# Altium schematic sheet microcontroller.SchDoc
size A4; SheetNumber: 1; SheetTotal: 3; SPICEModelCacheLTWMIPXS: <root> / <DocumentId>LTWMIPXS</DocumentId> / </root>
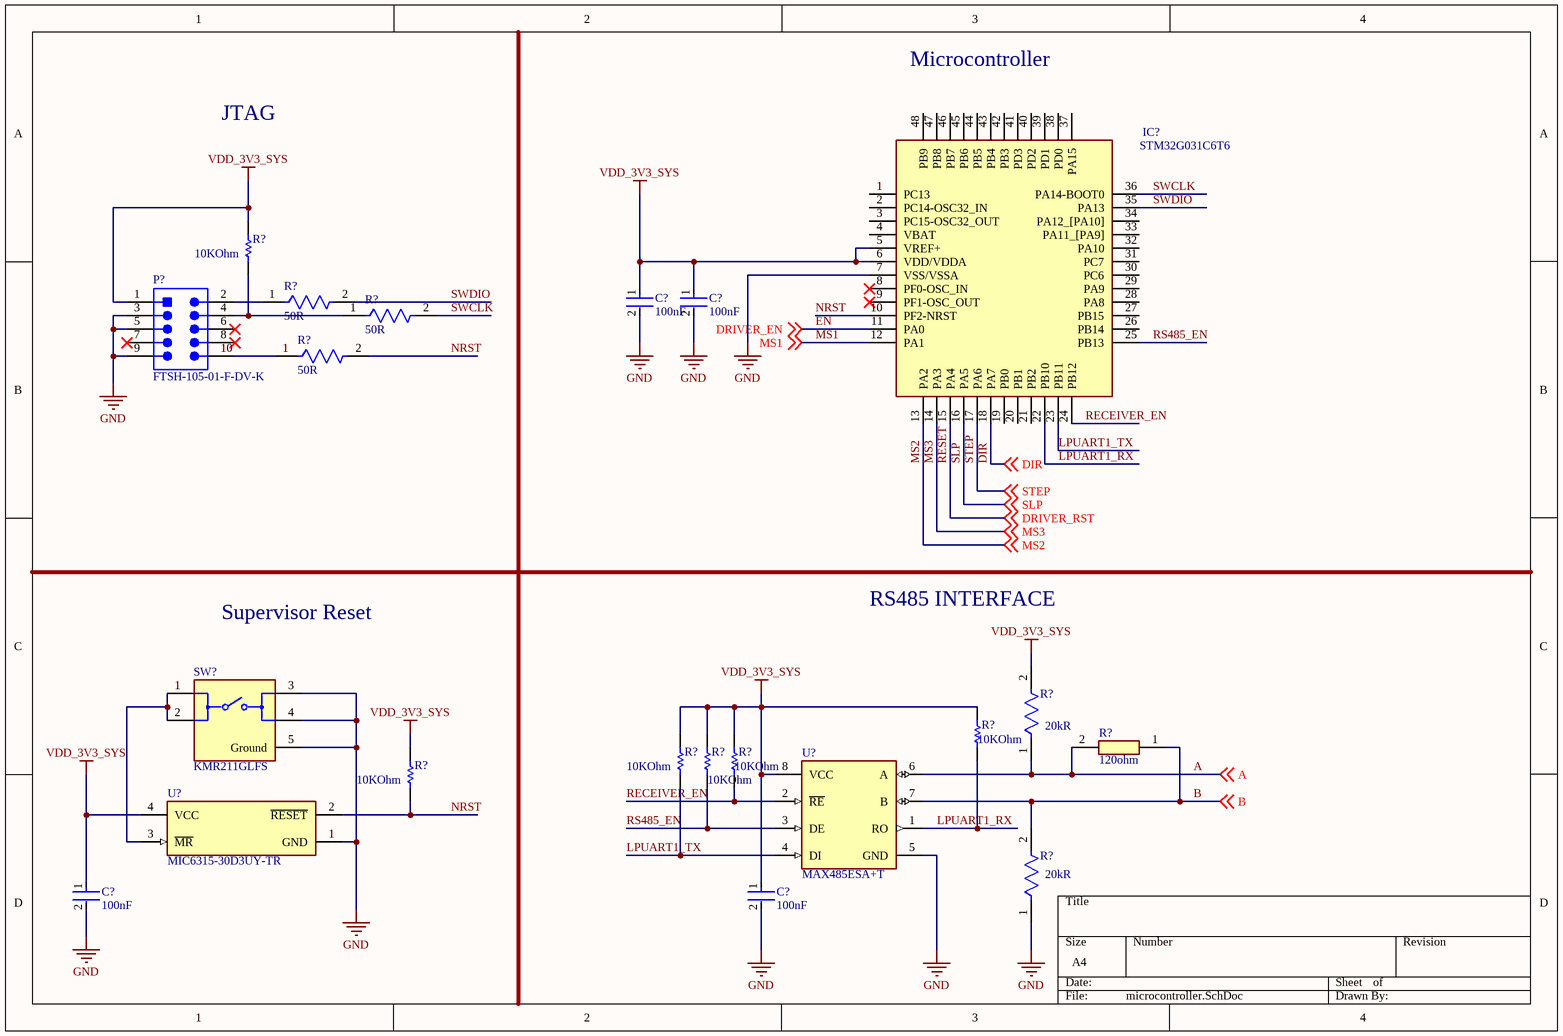
[diagram p0: microcontroller.SchDoc]

## Parts
(Parts that share a designator on the sheet are numbered #1, #2 ... from top to bottom, then left to right.)
C?#1  Capacitance: 100nF  [FP-CGA3E-0_3-0_1-IPC_A]  (hidden comment: CGA3E2X7R1H104K080AA)
C?#2  Capacitance: 100nF  [FP-CGA3E-0_3-0_1-IPC_A]  (hidden comment: CGA3E2X7R1H104K080AA)
C?#3  Capacitance: 100nF  [FP-CGA3E-0_3-0_1-IPC_A]  (hidden comment: CGA3E2X7R1H104K080AA)
C?#4  Capacitance: 100nF  [FP-CGA3E-0_3-0_1-IPC_A]  (hidden comment: CGA3E2X7R1H104K080AA)
IC?  STM32G031C6T6  [QFP50P900X900X160-48N]
P?  FTSH-105-01-F-DV-K  [SMTC-FTSH-105-01-L-DV-K_V]
R?#1  Resistance: 10KOhm  [RESC1609X55X30LL15T15]  (hidden comment: ERJ3EKF1002V)
R?#2  Resistance: 50R  [FP-FC0603-MFG]  (hidden comment: FC0603E50R0BTBST1)
R?#3  Resistance: 50R  [FP-FC0603-MFG]  (hidden comment: FC0603E50R0BTBST1)
R?#4  Resistance: 50R  [FP-FC0603-MFG]  (hidden comment: FC0603E50R0BTBST1)
R?#5  Resistance: 10KOhm  [RESC1609X55X30LL15T15]  (hidden comment: ERJ3EKF1002V)
R?#6  value 120ohm  [RESC1608X55N]  (hidden comment: CRG0603F120R)
R?#7  Resistance: 20kR  [FP-RC0603-0_55-IPC_B]  (hidden comment: RC0603FR-0720KL)
R?#8  Resistance: 10KOhm  [RESC1609X55X30LL15T15]  (hidden comment: ERJ3EKF1002V)
R?#9  Resistance: 10KOhm  [RESC1609X55X30LL15T15]  (hidden comment: ERJ3EKF1002V)
R?#10  Resistance: 10KOhm  [RESC1609X55X30LL15T15]  (hidden comment: ERJ3EKF1002V)
R?#11  Resistance: 10KOhm  [RESC1609X55X30LL15T15]  (hidden comment: ERJ3EKF1002V)
R?#12  Resistance: 20kR  [FP-RC0603-0_55-IPC_B]  (hidden comment: RC0603FR-0720KL)
SW?  KMR211GLFS  [FP-KMR211GLFS-MFG]
U?#1  MAX485ESA+T  [FP-S8-2-MFG]
U?#2  MIC6315-30D3UY-TR  [FP-SOT143-4LD-PL-1-MFG]

## Nets
GND: C?#1.2 C?#2.2 C?#3.2 C?#4.2 IC?.7(VSS/VSSA) P?.3 P?.5 P?.9 R?#12.1 SW?.3 SW?.4 SW?.5(Ground) U?#1.5(GND) U?#2.1(GND)
VDD_3V3_SYS: C?#1.1 C?#2.1 C?#3.1 C?#4.1 IC?.5(VREF+) IC?.6(VDD/VDDA) P?.1 R?#1.2 R?#5.2 R?#7.2 R?#8.2 R?#9.2 R?#10.2 R?#11.2 U?#1.8(VCC) U?#2.4(VCC)
A: R?#6.2 R?#7.1 U?#1.6(A) ; off-sheet A
B: R?#6.1 R?#12.2 U?#1.7(B) ; off-sheet B
DIR: IC?.18(PA7) ; off-sheet DIR
EN: IC?.11(PA0) ; off-sheet DRIVER_EN  [also labelled DRIVER_EN]
LPUART1_RX: IC?.22(PB10) R?#5.1 U?#1.1(RO)
LPUART1_TX: IC?.23(PB11) R?#8.1 U?#1.4(DI)
MS1: IC?.12(PA1) ; off-sheet MS1
MS2: IC?.13(PA2) ; off-sheet MS2
MS3: IC?.14(PA3) ; off-sheet MS3
NRST: IC?.10(PF2-NRST) R?#4.2 R?#11.1 U?#2.2(~{RESET})
RECEIVER_EN: IC?.24(PB12) R?#10.1 U?#1.2(~{RE})
RESET: IC?.15(PA4) ; off-sheet DRIVER_RST  [also labelled DRIVER_RST]
RS485_EN: IC?.25(PB13) R?#9.1 U?#1.3(DE)
SLP: IC?.16(PA5) ; off-sheet SLP
STEP: IC?.17(PA6) ; off-sheet STEP
SWCLK: IC?.36(PA14-BOOT0) R?#3.2
SWDIO: IC?.35(PA13) R?#2.2
NetP?_2: P?.2 R?#2.1
NetP?_4: P?.4 R?#1.1 R?#3.1
NetP?_10: P?.10 R?#4.1
NetSW?_1: SW?.1 SW?.2 U?#2.3(~{MR})

Not connected (* = marked no-connect by the designer): IC? 1(PC13) 2(PC14-OSC32_IN) 3(PC15-OSC32_OUT) 4(VBAT) 8(PF0-OSC_IN)* 9(PF1-OSC_OUT)* 19(PB0) 20(PB1) 21(PB2) 26(PB14) 27(PB15) 28(PA8) 29(PA9) 30(PC6) 31(PC7) 32(PA10) 33(PA11_[PA9]) 34(PA12_[PA10]) 37(PA15) 38(PD0) 39(PD1) 40(PD2) 41(PD3) 42(PB3) 43(PB4) 44(PB5) 45(PB6) 46(PB7) 47(PB8) 48(PB9); P? 6* 7* 8*

## Notes on the sheet
- Microcontroller
- JTAG
- Supervisor Reset
- RS485 INTERFACE

## Library data of the parts
C?#1-C?#4 = CMP-2000-07546-2: Cap Ceramic 100nF 50V X7R 10% Pad SMD 0603 +125°C Automotive T/R; Weight: 7.1E-05oz; Composition: Ceramic; Max Operating Temperature: 125°C; Termination: SMD/SMT; Dielectric: X7R; Length: 1.6mm; Package Quantity: 1; REACH SVHC: No SVHC; Lead Free: Lead Free; Case Code (Metric): 1608; Min Operating Temperature: -55°C; Packaging: Tape and Reel; Tolerance: 10%; Voltage Rating: 50V; Case Code (Imperial): 0603; Case/Package: 0603; Voltage Rating (DC): 50V; Depth: 0.8mm; Radiation Hardening: No; Ratings: AEC-Q200; Mount: Surface Mount; Voltage: 50V; Thickness: 0.035inch; Width: 0.8mm; Height: 0.8mm
IC? = STM32G031C6T6: Integrated Circuit; Manufacturer_Name: STMicroelectronics; Datasheet Link: https://www.st.com/resource/en/datasheet/stm32g031c6.pdf; Height: 1.6mm; Manufacturer_Part_Number: STM32G031C6T6; Mouser Part Number: 511-STM32G031C6T6; Mouser Price/Stock: https://www.mouser.co.uk/ProductDetail/STMicroelectronics/STM32G031C6T6?qs=uwxL4vQweFMtqlIt%2FRk%2Fog%3D%3D; Arrow Part Number: STM32G031C6T6; Arrow Price/Stock: https://www.arrow.com/en/products/stm32g031c6t6/stmicroelectronics?region=nac
P? = CMP-2000-05352-1: Male Header, Pitch 1.27 mm, 2 x 5 Position, Height 6.12 mm, RoHS, Tube; Manufacturer: Samtec; Number of Positions: 10; Connector Type: Header,Shrouded; Number of Positions Loaded: All; Row Spacing: 0.050"(1.27mm); Fastening Type: -; Package Reference: FTSH-105-01-L-DV-K; Termination: Solder; Package URL: http://suddendocs.samtec.com/prints/ftsh-1xx-xx-xxx-dv-xxx-footprint.pdf; Number of Rows: 2; Contact Finish Thickness: 3µin(0.08µm); Contact Type: MalePin; Manufacturer URL: http://www.samtec.com/; Contact Mating Length: 0.120"(3.05mm); Pitch: 0.050"(1.27mm); Series: FTSH; Features: -; Contact Finish: Gold; Color: Black; Family: RectangularConnectors-Headers,MalePins; Datasheet URL: http://suddendocs.samtec.com/prints/ftsh-1xx-xx-xxx-dv-xxx-mkt.pdf; Package Description: Male Header, Pitch 1.27 mm, 2 x 5 Position, Height 5.97 mm, Tail Length 4.32 mm; Mounting Type: SurfaceMount; Datasheet Version: Rev. ET, 10/1995; Category: Connectors,Interconnects; Packaging: Tube
R?#1 R?#5 R?#8-R?#11 = CMP-1012-00623-3: Chip Resistor, 10 KOhm, +/- 1%, 0.1 W, -55 to 155 degC, 0603 (1608 Metric), RoHS, Tape and Reel; Manufacturer: Panasonic; Voltage Rating: 75V; Case\/Package: 0603; Power Rating: 100mW; Temperature Coefficient: 100ppm\/degreesC; Number of Pins: 2; Package Reference: 603; Depth: 0.8mm; Mount: SurfaceMount; Package Description: 2-Pin Surface Mount Device, Body 1.6 x 0.85 mm; Datasheet Version: 02/2017; Length: 1.6mm; Lead Free: LeadFree; Height: 0.45mm; Number of Terminations: 2; Max Power Dissipation: 100mW; Min Operating Temperature: -55degC; Datasheet URL: https://industrial.panasonic.com/cdbs/www-data/pdf/RDA0000/AOA0000C304.pdf; Termination: SMD/SMT; Case Code (Metric): 1608; Case Code (Imperial): 0603; Tolerance: 1%; Max Operating Temperature: 155degC; RoHSCompliant: true; Voltage Rating (DC): 75V; Radiation Hardening: No; Packaging: TapeandReel; Composition: ThickFilm; Mounting Technology: SurfaceMount; Manufacturer URL: http://www.panasonic.com/; Width: 0.031inch; REACH SVHC: NoSVHC; Contact Plating: Tin; Military Standard: Not; Package Quantity: 1
R?#2-R?#4 = CMP-2000-03661-2: RES SMD 50 OHM 0.1% 1/8W 0603; Max Power Dissipation: 125mW; Voltage Rating (DC): 50V; Frequency: 20GHz; Temperature Coefficient: 25ppm/°C; Construction: Rectangular; Length: 0.064inch; Case/Package: 0603; Mount: Surface Mount; Case Code (Imperial): 0603; Military Standard: Not; Height: 0.015inch; RoHS Compliant: Yes; Depth: 0.81mm; Voltage Rating: 50V; Series: FC; Resistance Tolerance: 0.1%; Number of Terminations: 2; Min Operating Temperature: -55°C; Max Operating Temperature: 125°C; Power Rating: 125mW; Resistor Type: Thin Film; Termination: SMD/SMT; Packaging: Tape and Reel; Number of Pins: 2; Radiation Hardening: No; Width: 0.8mm; Tolerance: 0.1%; Contact Plating: Tin; Package Quantity: 1; Case Code (Metric): 1608
R?#6 = CRG0603F120R: Resistor; Manufacturer_Name: TE Connectivity; Datasheet Link: http://docs-europe.electrocomponents.com/webdocs/13d1/0900766b813d116f.pdf; Height: 0.55mm; Manufacturer_Part_Number: CRG0603F120R; Mouser Part Number: 279-CRG0603F120R; Mouser Price/Stock: https://www.mouser.co.uk/ProductDetail/TE-Connectivity-Holsworthy/CRG0603F120R?qs=VHcS2MTj4gbLzmSJaKDB9g%3D%3D; Arrow Part Number: CRG0603F120R; Arrow Price/Stock: https://www.arrow.com/en/products/crg0603f120r/te-connectivity
R?#7 R?#12 = CMP-2000-06932-2: RES 20K OHM 1% 1/10W 0603; Voltage Rating: 50V; Temperature Coefficient: 100ppm/°C; Power Rating: 100mW; Height: 0.022inch; REACH SVHC: No SVHC; Case Code (Metric): 1608; Depth: 0.8mm; Tolerance: 1%; Min Operating Temperature: -55°C; Series: RC; RoHS Compliant: Yes; Resistor Type: Thick Film; Max Power Dissipation: 100mW; Features: Moisture Resistant; Max Operating Temperature: 155°C; Package Quantity: 1; Size Code: 0603; Packaging: Tape and Reel; Width: 0.031inch; Length: 0.063inch; Military Standard: Not; Technology: THICK FILM; Number of Terminations: 2; Termination: SMD/SMT; Construction: Rectangular; Case/Package: 0603; Number of Pins: 2; Lead Free: Lead Free; Voltage Rating (DC): 50V; Resistance Tolerance: 1%; Case Code (Imperial): 0603
SW? = CMP-10040-000023-1: SWITCH TACTILE SPST-NO 0.05A 32V; Switch Function: Off-Mom; Throw Configuration: SPST; Switch Travel: 0.2mm; Current Rating: 50mA; Illumination Type: Non-Illuminated; Actuator Length: 0.5mm; Power Rating: 1W; Operating Force: 1.2N; Actuator Type: Standard; Mechanical Life: 200000Cycles; REACH SVHC: No SVHC; Voltage Rating (DC): 32V; Length: 2.8mm; Min Operating Temperature: -40°C; Mount: Surface Mount; Max Voltage Rating (DC): 32V; Width: 2.8mm; Depth: 4.6mm; Packaging: Tape and Reel; Lead Free: Lead Free; Contact Material: Silver; Termination: Gull Wing; Package Quantity: 1; Contact Current Rating: 50mA; Orientation: Straight; Max Operating Temperature: 85°C; Radiation Hardening: No; Max Current Rating: 50mA; Contact Plating: Silver
U?#1 = CMP-05679-000009-1: IC TRANSCEIVER HALF 1/1 8SOIC; Manufacturer: Maxim Integrated; Min Supply Voltage: 4.75V; Nominal Supply Current: 0.5mA; Number Of Transmitters: 1; Data Rate: 2.5Mbits/s; Interface: RS-485,RS-422; Standoff Height: 0.1mm; Max Supply Voltage: 5.25V; Simplex Duplex: Half-Duplex; Package: S8-2; Temperature: -40°C to +85°C; Device Class L1: Integrated Circuits (ICs); Footprint Url: https://pdfserv.maximintegrated.com/land_patterns/90-0096.PDF; ComponentLink2URL: https://datasheets.maximintegrated.com/en/ds/MAX1487-MAX491.pdf; Height: 1.75mm; Mouser Description: RS-422/RS-485 Interface IC RS-485/RS-422 Transceiver; Octopart: https://octopart.com/max485esa%2Bt-maxim+integrated-40011239; RoHS: TRUE; ComponentLink2Description: Datasheet; Temperature Range Low: -40°C; Number Of Receivers: 1; Manufacturer Part Number: MAX485ESA+T; Ipc Land Pattern Name: SOIC127P600X155-8; Device Class L3: RS-232 / RS-422 / RS-485 Interface ICs; Automotive: No; Digikey Description: IC TRANSCEIVER HALF 1/1 8SOIC; Temperature Range High: +85°C; Category: IC; Device Class L2: Interface ICs; Lead Free: Yes
U?#2 = CMP-06326-000025-1: IC SUPERVISOR 1 CHANNEL SOT143; Max Reset Threshold Voltage: 3.08V; Max Power Dissipation: 320mW; Watchdog Timer: No; Reset: Active Low; Reset Timeout: 140ms; Min Reset Threshold Voltage: 2.92V; Threshold Voltage: 3V; Operating Supply Current: 5uA; Max Supply Voltage: 5.5V; Number of Elements: 1; Min Supply Voltage: 1V; Power Dissipation: 320mW; Packaging: Tape and Reel; Max Operating Temperature: 85°C; Radiation Hardening: No; Series: -; Type: Simple Reset/Power-On Reset; Case/Package: SOT-143; RoHS Compliant: Yes; Min Operating Temperature: -40°C; Number of Pins: 4; Length: 3.05mm; Mount: Surface Mount; Lead Free: Lead Free; Width: 1.4mm; Reach SVHC Compliant: Yes; Height: 1.02mm; Number of Voltages Monitored: 1